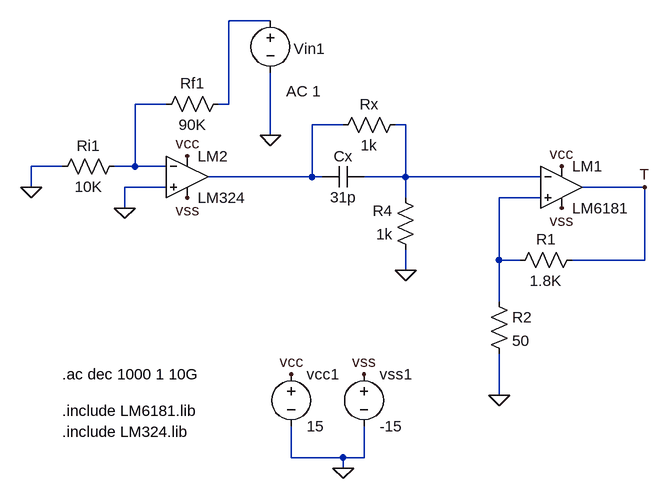
[diagram p0: schematic simulacion2.asc]
simulacion2.asc, the LTspice schematic file:
Version 4.1
SHEET 1 880 680
WIRE 80 -224 16 -224
WIRE -80 -96 -128 -96
WIRE 16 -96 16 -224
WIRE 16 -96 0 -96
WIRE 192 -64 144 -64
WIRE 288 -64 272 -64
WIRE 80 -48 80 -144
WIRE -240 0 -288 0
WIRE -128 0 -128 -96
WIRE -128 0 -160 0
WIRE -80 0 -128 0
WIRE 144 16 144 -64
WIRE 144 16 -16 16
WIRE 160 16 144 16
WIRE 288 16 288 -64
WIRE 288 16 224 16
WIRE 496 16 288 16
WIRE -288 32 -288 0
WIRE -80 32 -144 32
WIRE 656 32 560 32
WIRE 288 48 288 16
WIRE 496 48 432 48
WIRE -144 64 -144 32
WIRE 432 144 432 48
WIRE 464 144 432 144
WIRE 656 144 656 32
WIRE 656 144 544 144
WIRE 288 160 288 128
WIRE 432 208 432 144
WIRE 432 352 432 288
WIRE 112 448 112 400
WIRE 192 448 112 448
WIRE 224 448 224 400
WIRE 224 448 192 448
WIRE 192 464 192 448
FLAG 432 352 0
FLAG -288 32 0
FLAG 112 320 vcc
FLAG -48 -16 vcc
FLAG 528 0 vcc
FLAG 224 320 vss
FLAG 528 64 vss
FLAG -48 48 vss
FLAG 192 464 0
FLAG 80 -48 0
FLAG 288 160 0
FLAG 656 32 T
FLAG -144 64 0
SYMBOL OpAmps\\opamp2 528 -32 R0
SYMATTR InstName LM1
SYMATTR Value LM6181
SYMBOL voltage 112 304 R0
SYMATTR InstName vcc1
SYMATTR Value 15
SYMBOL voltage 224 304 R0
SYMATTR InstName vss1
SYMATTR Value -15
SYMBOL OpAmps\\opamp2 -48 -48 R0
SYMATTR InstName LM2
SYMATTR Value LM324
SYMBOL res -144 -16 R90
WINDOW 0 0 56 VBottom 2
WINDOW 3 32 56 VTop 2
SYMATTR InstName Ri1
SYMATTR Value 10K
SYMBOL res 16 -112 R90
WINDOW 0 0 56 VBottom 2
WINDOW 3 32 56 VTop 2
SYMATTR InstName Rf1
SYMATTR Value 90K
SYMBOL res 560 128 R90
WINDOW 0 0 56 VBottom 2
WINDOW 3 32 56 VTop 2
SYMATTR InstName R1
SYMATTR Value 1.8K
SYMBOL res 416 192 R0
SYMATTR InstName R2
SYMATTR Value 50
SYMBOL voltage 80 -240 R0
WINDOW 0 36 59 Left 2
WINDOW 123 24 124 Left 2
WINDOW 39 0 0 Left 0
SYMATTR InstName Vin1
SYMATTR Value ""
SYMATTR Value2 AC 1
SYMBOL res 288 -80 R90
WINDOW 0 0 56 VBottom 2
WINDOW 3 32 56 VTop 2
SYMATTR InstName Rx
SYMATTR Value 1k
SYMBOL res 304 144 R180
WINDOW 0 36 76 Left 2
WINDOW 3 36 40 Left 2
SYMATTR InstName R4
SYMATTR Value 1k
SYMBOL cap 224 0 R90
WINDOW 0 0 32 VBottom 2
WINDOW 3 32 32 VTop 2
SYMATTR InstName Cx
SYMATTR Value 31p
TEXT -240 376 Left 2 !.include LM6181.lib
TEXT -240 408 Left 2 !.include LM324.lib
TEXT -240 320 Left 2 !.ac dec 1000 1 10G

The netlist it stands for:
* simulacion2.asc
X§LM1 N005 N004 vcc vss T LM6181  ; pins In+ In- V+ V- OUT
vcc1 vcc 0 15
vss1 vss 0 -15
X§LM2 0 N002 vcc vss N003 LM324  ; pins In+ In- V+ V- OUT
Ri1 N002 0 10K
Rf1 N001 N002 90K
R1 T N005 1.8K
R2 N005 0 50
Vin1 N001 0 AC 1
Rx N004 N003 1k
R4 0 N004 1k
Cx N004 N003 31p
.include LM6181.lib
.include LM324.lib
.ac dec 1000 1 10G
.backanno
.end